# Altium project LM-003-D.PrjPcb
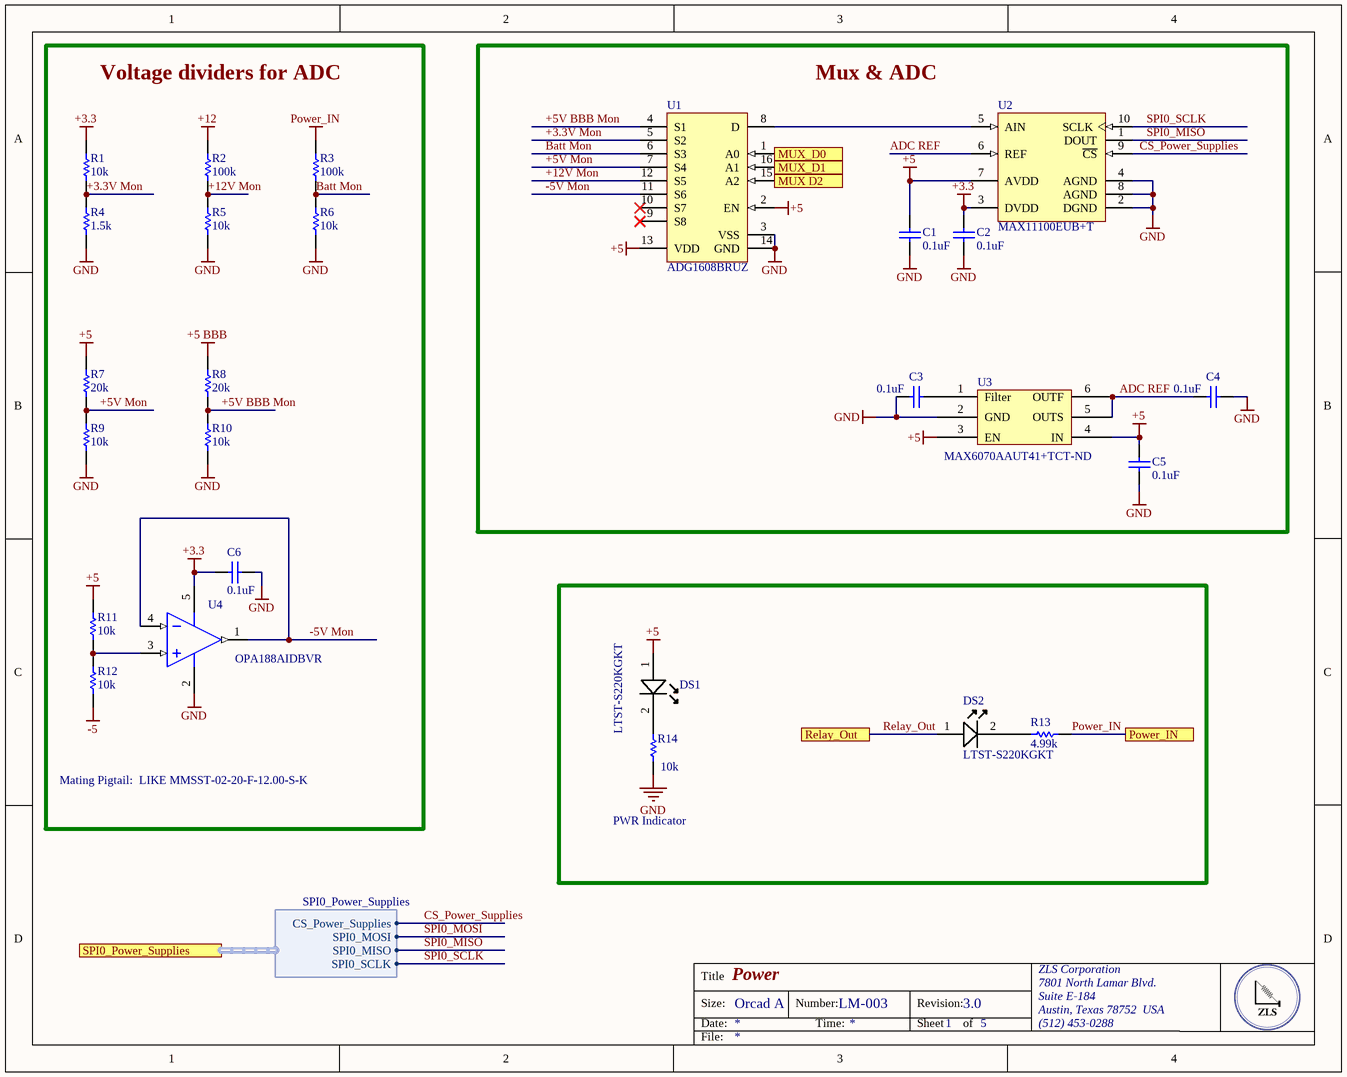
[diagram p0: Power.SchDoc]
4 sheets, 55 parts. Net scope: flat (ports and power ports of the same name join across sheets).
Board file: LM-003.PcbDoc
Sheets:
  Power.SchDoc
  BBB Headers.SchDoc
  Connectors.SchDoc
  heater_control.SchDoc

## Sheet Power.SchDoc: Power
size OrCAD A; DocumentNumber: LM-003; Revision: 3.0; SheetNumber: 1; SheetTotal: 5

### Parts
C1  0.1uF  [CAPC0402(1005)60_L]
C2  0.1uF  [CAPC0402(1005)60_L]
C3  0.1uF  [CAPC0402(1005)60_L]
C4  0.1uF  [CAPC0402(1005)60_L]
C5  0.1uF  [CAPC0402(1005)60_L]
C6  0.1uF  [CAPC0402(1005)60_L]
DS1  Manufacturer Part Number: LTST-S220KGKT  [0805C_L]  (hidden comment: Lite-On LTST-S220KGKT Green LED, 571 nm 2012 (0805) Side View, Rectangle Lens SMD package)
DS2  Manufacturer Part Number: LTST-S220KGKT  [0805C_L]  (hidden comment: Lite-On LTST-S220KGKT Green LED, 571 nm 2012 (0805) Side View, Rectangle Lens SMD package)
R1  10k  [RESC0402(1005)_M]
R2  100k  [RESC0402(1005)_M]
R3  100k  [RESC0402(1005)_M]
R4  1.5k  [RESC0402(1005)_M]
R5  10k  [RESC0402(1005)_M]
R6  10k  [RESC0402(1005)_M]
R7  20k  [RESC0402(1005)_M]
R8  20k  [RESC0402(1005)_M]
R9  10k  [RESC0402(1005)_M]
R10  10k  [RESC0402(1005)_M]
R11  10k  [RESC0402(1005)_M]
R12  10k  [RESC0402(1005)_M]
R13  4.99k  [RESC0402(1005)_M]
R14  10k  [RESC0402(1005)_M]
U1  ADG1608BRUZ  [ADI-RU-16_M]
U2  MAX11100EUB+T  [U10+2_L]
U3  Supplier Part Number 1: MAX6070AAUT41+TCT-ND  [SOT95P280X445-6N]  (hidden comment: MAX6070AAUT41+T)
U4  OPA188AIDBVR  [DBV0005A_M]

### Blocks framed on the sheet
Voltage dividers for ADC: C6 R1-R12 U4
Mux & ADC: C1-C5 U1-U3
PWR Indicator: DS1 DS2 R13 R14

### Ports
MUX D2, MUX_D0, MUX_D1, Power_IN, Relay_Out, SPI0_Power_Supplies (harness SPI0_Power_Supplies)

### Harnesses
SPI0_Power_Supplies: CS_Power_Supplies, SPI0_MOSI, SPI0_MISO, SPI0_SCLK

### Nets
+3.3: C2.1 C6.1 R1.2 U2.3(DVDD) U4.5(V+)
+5: C1.1 C5.1 DS1.1(A) R7.2 R11.2 U1.2(EN) U1.13(VDD) U2.7(AVDD) U3.3(EN) U3.4(IN)
+5 BBB: R8.2
+12: R2.2
-5: R12.1
GND: C1.2 C2.2 C3.2 C4.1 C5.2 C6.2 R4.1 R5.1 R6.1 R9.1 R10.1 R14.2 U1.3(VSS) U1.14(GND) U2.2(DGND) U2.4(AGND) U2.8(AGND) U3.2(GND) U4.2(V-)
Power_IN: R3.2 R13.2 ; port Power_IN
+3.3V Mon: R1.1 R4.2 U1.5(S2)
+5V BBB Mon: R8.1 R10.2 U1.4(S1)
+5V Mon: R7.1 R9.2 U1.7(S4)
+12V Mon: R2.1 R5.2 U1.12(S5)
-5V Mon: U1.11(S6) U4.1(OUT) U4.4(IN-)
ADC REF: C4.2 U2.6(REF) U3.5(OUTS) U3.6(OUTF)
Batt Mon: R3.1 R6.2 U1.6(S3)
CS_Power_Supplies: U2.9(~{CS}) ; port SPI0_Power_Supplies.CS_Power_Supplies
Relay_Out: DS2.1(A) ; port Relay_Out
SPI0_MISO: U2.1(DOUT) ; port SPI0_Power_Supplies.SPI0_MISO
SPI0_MOSI: port SPI0_Power_Supplies.SPI0_MOSI
SPI0_SCLK: U2.10(SCLK) ; port SPI0_Power_Supplies.SPI0_SCLK
NetC3_1: C3.1 U3.1(Filter)
NetDS1_2: DS1.2(K) R14.1
NetDS2_2: DS2.2(K) R13.1
NetR11_1: R11.1 R12.2 U4.3(IN+)
NetU1_1: U1.1(A0) ; port MUX_D0
NetU1_8: U1.8(D) U2.5(AIN)
NetU1_15: U1.15(A2) ; port MUX D2
NetU1_16: U1.16(A1) ; port MUX_D1

Not connected (* = marked no-connect by the designer): U1 9(S8)* 10(S7)*

### Notes on the sheet
- Mating Pigtail:  LIKE MMSST-02-20-F-12.00-S-K
- Title
- Size:
- Date:
- Orcad A
- Number:
- Time:
- Revision:
- Sheet
- of
- ZLS Corporation
- 7801 North Lamar Blvd.
- Suite E-184
- Austin, Texas 78752  USA
- (512) 453-0288
- File:

### Library data of the parts
C1-C6 = CMP-1034-00252-1: CAP CER 0.1UF 10V X7R 0402; Manufacturer: Murata Electronics North America; Manufacturer Part Number: GRM155R71A104KA01D; Tolerance: ±10%; Supplier 1: Digi-Key; Supplier Part Number 1: 490-6321-1-ND; RoHS: RoHS Compliant; Category: Capacitors; Stock 1: 2920395; Pricing 1: 1=0.1, 10=0.014, 100=0.0063, 500=0.00446, 1000=0.00351, 2500=0.00319, 5000=0.00293 (USD); Packaging: Cut Tape (CT); Part Status: Active; Voltage - Rated: 10V; Temperature Coefficient: X7R; Operating Temperature: -55°C ~ 125°C; Features: -; Ratings: -; Applications: General Purpose; Mounting Type: Surface Mount, MLCC; Package / Case: 0402 (1005 Metric); Size / Dimension: 0.039" L x 0.020" W (1.00mm x 0.50mm); Height - Seated (Max): -; Thickness (Max): 0.022" (0.55mm); Lead Spacing: -; ComponentLink1URL: http://www.murata.com/~/media/webrenewal/support/library/catalog/products/capacitor/mlcc/c02e.ashx?la=en-us; ComponentLink1Description: http://www.murata.com/~/media/webrenewal/support/library/catalog/products/capacitor/mlcc/c02e.ashx?la=en-us
DS1 DS2 = LED A/K: Manufacturer: Vishay / Lite-On; Lens Colour: Colorless; Viewing Angle: 130°; Luminous Intensity: 35mcd; Forward Current: 20mA; Forward Voltage: 2V; Lens Style: Diffused,Colorless; Power Rating: 75mW; Dominant Wavelength: 568nm; Lens Transparency: Clear; Number of Elements: 1; Power Dissipation: 75W; Wavelength: 574nm; Supplier 1: Digi-Key; Supplier Part Number 1: 160-1468-1-ND; Stock 1: 74800; Pricing 1: 1=0.29, 10=0.212, 25=0.1564, 100=0.1117, 250=0.0759, 500=0.067, 1000=0.0525 (USD); Mount: Surface Mount; Case/Package: 0805; Number of Pins: 2; Colour: Green; Case Code (Metric): 2012; Case Code (Imperial): 0805; Min Operating Temperature: -55°C; Max Operating Temperature: 85°C; Packaging: Tape and Reel; Package Quantity: 4000; Illumination Colour: Green; Test Current: 20mA; Number of LEDs: 1; Length: 2.1mm; Height: 0.6mm; Width: 1mm; Depth: 0.6mm; Radiation Hardening: No; Lead Free: Lead Free; ComponentLink1URL: https://datasheet.ciiva.com/11775/0900766b80dc0b70-11775441.pdf; ComponentLink1Description: https://datasheet.ciiva.com/11775/0900766b80dc0b70-11775441.pdf; ComponentLink2URL: https://datasheet.ciiva.com/2110/s-110-ltst-s220kgkt-2110069.pdf; ComponentLink2Description: https://datasheet.ciiva.com/2110/s-110-ltst-s220kgkt-2110069.pdf; ComponentLink3URL: https://datasheet.ciiva.com/2110/s-110-ltst-s220kgkt-2110070.pdf; ComponentLink3Description: https://datasheet.ciiva.com/2110/s-110-ltst-s220kgkt-2110070.pdf; ComponentLink4URL: https://datasheet.ciiva.com/12400/100-ltst-s220kgkt-59602-12400886.pdf; ComponentLink4Description: https://datasheet.ciiva.com/12400/100-ltst-s220kgkt-59602-12400886.pdf; ComponentLink5URL: https://datasheet.ciiva.com/2110/s-110-ltst-s220kgkt-2110071.pdf; ComponentLink5Description: https://datasheet.ciiva.com/2110/s-110-ltst-s220kgkt-2110071.pdf; ComponentLink6URL: https://datasheet.ciiva.com/16379/ltst-s220kgkt-16379082.pdf; ComponentLink6Description: https://datasheet.ciiva.com/16379/ltst-s220kgkt-16379082.pdf
  DS2: Supplier 2: Farnell; Supplier Part Number 2: 2062310; RoHS: YES; Stock 2: 2271; Pricing 2: 1=0.325, 10=0.317, 100=0.23, 200=0.228, 400=0.182, 900=0.147, 3000=0.114, 9000=0.107 (GBP); ComponentLink7URL: http://www.farnell.com/cad/2124774.pdf; ComponentLink7Description: http://www.farnell.com/cad/2124774.pdf; ComponentLink8URL: http://www.farnell.com/datasheets/693084.pdf; ComponentLink8Description: http://www.farnell.com/datasheets/693084.pdf
R1-R14 = CMP-1011-00651-1
U1 = CMP-0793-00136-1: 4.5 Ohm Ron, 8-Channel +/-5 V,+12 V, +5 V and +3.3 V Multiplexer, 16-pin SOP (RU-16), Tube; Manufacturer: Analog Devices; Max Analog Signal Range: 0 to Vdd; Ron (ohms): 4.4; t transition (s): 150n; Bandwidth (Hz): 40M, 40M, 37M, 34M; Code_JEDEC: MO-153AB; PackageReference: RU-16; PackageDescription: 16-Pin Thin Shrink Small Outline Package, Body 5 x 4.4 mm, Pitch 0.65 mm; ComponentLink1Description: Manufacturer URL; ComponentLink2Description: Datasheet; PartNumber: ADG1608BRUZ; Mounting Technology: Surface Mount; PackageVersion: Nov-02; ComponentLink3Description: Package Specification; DatasheetVersion: Rev. 0; Packing: Tube; ComponentLink1URL: http://www.analog.com/en/index.html; ComponentLink3URL: http:/www.analog.com/static/imported-files/packages/36244347913743854010197452789RU16.pdf; ComponentLink2URL: http://www.analog.com/static/imported-files/data_sheets/ADG1608_1609.pdf
U2 = CMP-0249-00017-1: 16-Bit, +5V, 200ksps ADC with 10uA Shutdown, 10-Pin uMAX, -40°C to +85°C, Pb-Free, Tape and Reel; DatasheetVersion: Rev 1, Jan-2012; ComponentLink3URL: http://pdfserv.maxim-ic.com/package_dwgs/21-0061.PDF; PackageReference: U10+2; ComponentLink2URL: http://datasheets.maxim-ic.com/en/ds/MAX11100.pdf; PackageVersion: revL, 2008; ComponentLink1Description: Manufacturer URL; Code_JEDEC: MO-187-BA; ComponentLink1URL: http://www.maxim-ic.com; ComponentLink3Description: Package Specification; PackageDescription: 10-Pin Micro-MAX Thin Shrink Small Outline (uSOP), 3 x 3 x 0.85 mm Body, 0.5 mm Pitch, Pb-Free; ComponentLink2Description: Datasheet
U3 = MAX6070AAUT41+T: IC VREF SERIES 4.096V SOT23; Manufacturer: Maxim Integrated; Output Type: Fixed; Tolerance: ±0.04%; Temperature Coefficient: 6ppm/°C; Noise - 0.1Hz to 10Hz: 9.6µVp-p; Noise - 10Hz to 10kHz: 9µVrms; Voltage - Input: 4.3 V ~ 5.5 V; Current - Supply: 350µA; Supplier 1: Digi-Key; Manufacturer Part Number: MAX6070AAUT41+T; RoHS: RoHS Compliant; Category: Integrated Circuits (ICs); Stock 1: 2623; Pricing 1: 1=3.41, 10=3.213, 25=2.5704, 50=2.4418, 100=2.2491, 250=2.13344, 500=2.05634 (USD); Packaging: Cut Tape (CT); Part Status: Active; Reference Type: Series; Voltage - Output (Min/Fixed): 4.096V; Operating Temperature: -40°C ~ 125°C (TA); Mounting Type: Surface Mount; Package / Case: SOT-23-6; Supplier Device Package: SOT-23-6; ComponentLink1URL: https://datasheets.maximintegrated.com/en/ds/MAX6070-MAX6071.pdf; ComponentLink1Description: https://datasheets.maximintegrated.com/en/ds/MAX6070-MAX6071.pdf
U4 = CMP-0809-00005-2: Precision, Low Noise, Rail-to-Rail Output, Zero-Drift Operational Amplifier, 4 to 36 V, -40 to 125 degC, 5-pin SOT23 (DBV5), Green (RoHS & no Sb/Br); Manufacturer: Texas Instruments; Total Supply Voltage(Min)(+5V is 5, +/-5V is 10): 4; Offset Drift(Typ)(uV/C): 0.03; Rating: Catalog; SubFamily: Zero Drift Precision Amplifier; GBW(Typ)(MHz): 2; Slew Rate(Typ)(V/us): 0.8; Number of Channels: 1; CMRR(Min)(dB): 120; Iq per channel(Max)(mA): 0.51; Total Supply Voltage(Max)(+5V is 5, +/-5V is 10): 36; PartNumber: OPA188AIDBVR; ComponentLink2Description: Datasheet; ComponentLink2URL: http://www.ti.com/lit/ds/symlink/opa188.pdf; ComponentLink1Description: Manufacturer URL; Mounting Technology: Surface Mount; Eco-Plan: Green (RoHS & no Sb/Br); ComponentLink1URL: http://www.ti.com/; PackageVersion: 4073253-4/K, 03/2006; DatasheetVersion: SBOS642A; ComponentLink3Description: Package Specification; PackageReference: DBV0005A; ComponentLink3URL: http://www.ti.com/litv/pdf/mpds018i; PackageDescription: 5-Pin Plastic Small Outline, Body 1.6 x 2.9 mm, Pitch 0.95 mm; Code_JEDEC: MO-178

## Sheet BBB Headers.SchDoc: BBB Headers
size Tabloid; DocumentNumber: LM-003; Revision: 3.0; SheetNumber: 2; SheetTotal: 5
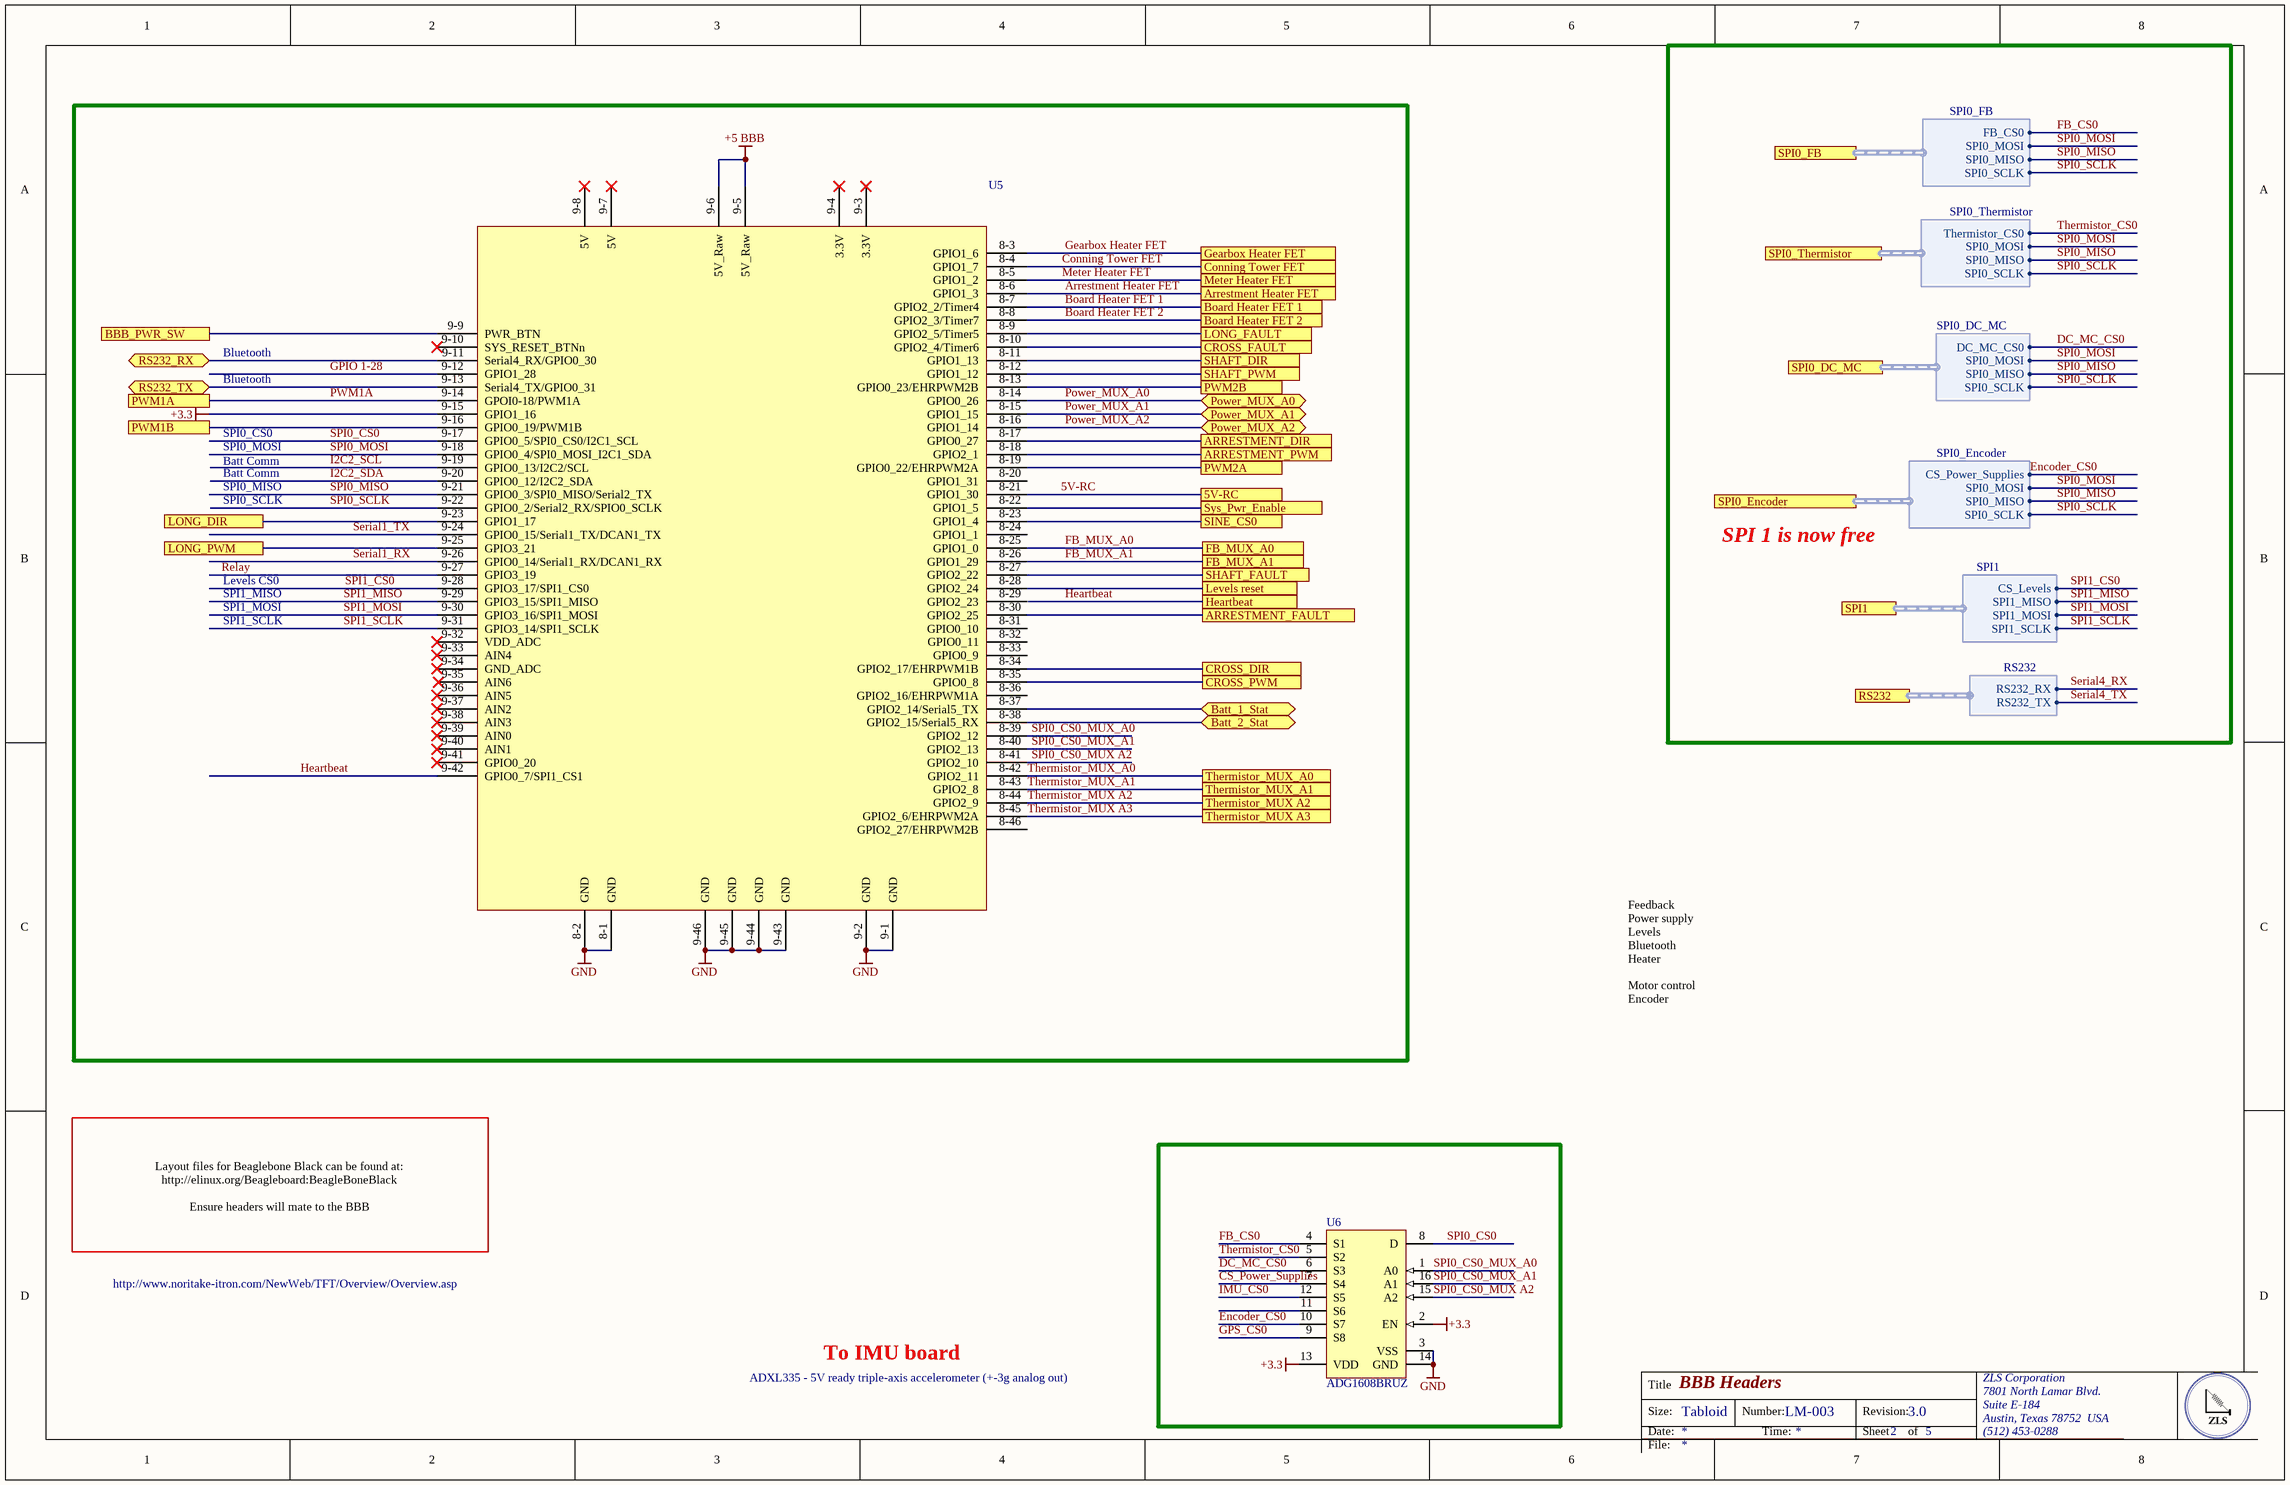
[diagram p1: BBB Headers.SchDoc]

### Parts
U5  BBB  [Beaglebone Black]  (value not drawn)
U6  ADG1608BRUZ  [ADI-RU-16_M]

### Ports
5V-RC, Arrestment Heater FET, ARRESTMENT_DIR, ARRESTMENT_FAULT, ARRESTMENT_PWM, Batt_1_Stat, Batt_2_Stat, BBB_PWR_SW, Board Heater FET 1, Board Heater FET 2, Conning Tower FET, CROSS_DIR, CROSS_FAULT, CROSS_PWM, FB_MUX_A0, FB_MUX_A1, Gearbox Heater FET, Heartbeat, Levels reset, LONG_DIR, LONG_FAULT, LONG_PWM, Meter Heater FET, Power_MUX_A0, Power_MUX_A1, Power_MUX_A2, PWM1A, PWM1B, PWM2A, PWM2B, RS232 (harness RS232), RS232_RX, RS232_TX, SHAFT_DIR, SHAFT_FAULT, SHAFT_PWM, SINE_CS0, SPI0_DC_MC (harness SPI0_DC_MC), SPI0_Encoder (harness SPI0_Encoder), SPI0_FB (harness SPI0_FB), SPI0_Thermistor (harness SPI0_Thermistor), SPI1 (harness SPI1), Sys_Pwr_Enable, Thermistor_MUX A2, Thermistor_MUX A3, Thermistor_MUX_A0, Thermistor_MUX_A1

### Harnesses
RS232: RS232_RX, RS232_TX
SPI1: CS_Levels, SPI1_MISO, SPI1_MOSI, SPI1_SCLK
SPI0_DC_MC: DC_MC_CS0, SPI0_MOSI, SPI0_MISO, SPI0_SCLK
SPI0_Encoder: CS_Power_Supplies, SPI0_MOSI, SPI0_MISO, SPI0_SCLK
SPI0_Thermistor: Thermistor_CS0, SPI0_MOSI, SPI0_MISO, SPI0_SCLK
SPI0_FB: FB_CS0, SPI0_MOSI, SPI0_MISO, SPI0_SCLK

### Nets
+3.3: U5.9-15(GPIO1_16) U6.2(EN) U6.13(VDD)
+5 BBB: U5.9-5(5V_Raw) U5.9-6(5V_Raw)
GND: U5.8-1(GND) U5.8-2(GND) U5.9-1(GND) U5.9-2(GND) U5.9-43(GND) U5.9-44(GND) U5.9-45(GND) U5.9-46(GND) U6.3(VSS) U6.14(GND)
5V-RC: U5.8-21(GPIO1_30) ; port 5V-RC
Arrestment Heater FET: U5.8-6(GPIO1_3) ; port Arrestment Heater FET
Batt_1_Stat: U5.8-37(GPIO2_14/Serial5_TX) ; port Batt_1_Stat
Batt_2_Stat: U5.8-38(GPIO2_15/Serial5_RX) ; port Batt_2_Stat
BBB_PWR_SW: U5.9-9(PWR_BTN) ; port BBB_PWR_SW
Board Heater FET 1: U5.8-7(GPIO2_2/Timer4) ; port Board Heater FET 1
Board Heater FET 2: U5.8-8(GPIO2_3/Timer7) ; port Board Heater FET 2
Conning Tower FET: U5.8-4(GPIO1_7) ; port Conning Tower FET
CS_Power_Supplies: U6.7(S4)
DC_MC_CS0: U6.6(S3) ; port SPI0_DC_MC.DC_MC_CS0
Encoder_CS0: U6.10(S7) ; port SPI0_Encoder.CS_Power_Supplies
FB_CS0: U6.4(S1) ; port SPI0_FB.FB_CS0
FB_MUX_A0: U5.8-25(GPIO1_0) ; port FB_MUX_A0
FB_MUX_A1: U5.8-26(GPIO1_29) ; port FB_MUX_A1
Gearbox Heater FET: U5.8-3(GPIO1_6) ; port Gearbox Heater FET
GPIO 1-28: U5.9-12(GPIO1_28)
GPS_CS0: U6.9(S8)
Heartbeat: U5.9-42(GPIO0_7/SPI1_CS1) ; port Heartbeat
I2C2_SCL: U5.9-19(GPIO0_13/I2C2/SCL)
I2C2_SDA: U5.9-20(GPIO0_12/I2C2_SDA)
IMU_CS0: U6.12(S5)
Meter Heater FET: U5.8-5(GPIO1_2) ; port Meter Heater FET
Power_MUX_A0: U5.8-14(GPIO0_26) ; port Power_MUX_A0
Power_MUX_A1: U5.8-15(GPIO1_15) ; port Power_MUX_A1
Power_MUX_A2: U5.8-16(GPIO1_14) ; port Power_MUX_A2
PWM1A: U5.9-14(GPOI0-18/PWM1A) ; port PWM1A
PWM2A: U5.8-19(GPIO0_22/EHRPWM2A) ; port PWM2A
PWM2B: U5.8-13(GPIO0_23/EHRPWM2B) ; port PWM2B
Relay: U5.9-27(GPIO3_19)
Serial1_RX: U5.9-26(GPIO0_14/Serial1_RX/DCAN1_RX)
Serial1_TX: U5.9-24(GPIO0_15/Serial1_TX/DCAN1_TX)
Serial4_RX: port RS232.RS232_RX
Serial4_TX: port RS232.RS232_TX
SPI0_CS0: U5.9-17(GPIO0_5/SPI0_CS0/I2C1_SCL) U6.8(D)
SPI0_CS0_MUX A2: U5.8-41(GPIO2_10) U6.15(A2)
SPI0_CS0_MUX_A0: U5.8-39(GPIO2_12) U6.1(A0)
SPI0_CS0_MUX_A1: U5.8-40(GPIO2_13) U6.16(A1)
SPI0_MISO: U5.9-21(GPIO0_3/SPI0_MISO/Serial2_TX) ; port SPI0_DC_MC.SPI0_MISO, port SPI0_Encoder.SPI0_MISO, port SPI0_Thermistor.SPI0_MISO, port SPI0_FB.SPI0_MISO
SPI0_MOSI: U5.9-18(GPIO0_4/SPI0_MOSI_I2C1_SDA) ; port SPI0_DC_MC.SPI0_MOSI, port SPI0_Encoder.SPI0_MOSI, port SPI0_Thermistor.SPI0_MOSI, port SPI0_FB.SPI0_MOSI
SPI0_SCLK: U5.9-22(GPIO0_2/Serial2_RX/SPIO0_SCLK) ; port SPI0_DC_MC.SPI0_SCLK, port SPI0_Encoder.SPI0_SCLK, port SPI0_Thermistor.SPI0_SCLK, port SPI0_FB.SPI0_SCLK
SPI1_CS0: U5.9-28(GPIO3_17/SPI1_CS0) ; port SPI1.CS_Levels
SPI1_MISO: U5.9-29(GPIO3_15/SPI1_MISO) ; port SPI1.SPI1_MISO
SPI1_MOSI: U5.9-30(GPIO3_16/SPI1_MOSI) ; port SPI1.SPI1_MOSI
SPI1_SCLK: U5.9-31(GPIO3_14/SPI1_SCLK) ; port SPI1.SPI1_SCLK
Sys_Pwr_Enable: U5.8-22(GPIO1_5) ; port Sys_Pwr_Enable
Thermistor_CS0: U6.5(S2) ; port SPI0_Thermistor.Thermistor_CS0
Thermistor_MUX A2: U5.8-44(GPIO2_9) ; port Thermistor_MUX A2
Thermistor_MUX A3: U5.8-45(GPIO2_6/EHRPWM2A) ; port Thermistor_MUX A3
Thermistor_MUX_A0: U5.8-42(GPIO2_11) ; port Thermistor_MUX_A0
Thermistor_MUX_A1: U5.8-43(GPIO2_8) ; port Thermistor_MUX_A1
NetU5_8-9: U5.8-9(GPIO2_5/Timer5) ; port LONG_FAULT
NetU5_8-10: U5.8-10(GPIO2_4/Timer6) ; port CROSS_FAULT
NetU5_8-11: U5.8-11(GPIO1_13) ; port SHAFT_DIR
NetU5_8-12: U5.8-12(GPIO1_12) ; port SHAFT_PWM
NetU5_8-17: U5.8-17(GPIO0_27) ; port ARRESTMENT_DIR
NetU5_8-18: U5.8-18(GPIO2_1) ; port ARRESTMENT_PWM
NetU5_8-23: U5.8-23(GPIO1_4) ; port SINE_CS0
NetU5_8-27: U5.8-27(GPIO2_22) ; port SHAFT_FAULT
NetU5_8-28: U5.8-28(GPIO2_24) ; port Levels reset
NetU5_8-30: U5.8-30(GPIO2_25) ; port ARRESTMENT_FAULT
NetU5_8-34: U5.8-34(GPIO2_17/EHRPWM1B) ; port CROSS_DIR
NetU5_8-35: U5.8-35(GPIO0_8) ; port CROSS_PWM
NetU5_9-11: U5.9-11(Serial4_RX/GPIO0_30) ; port RS232_RX
NetU5_9-13: U5.9-13(Serial4_TX/GPIO0_31) ; port RS232_TX
NetU5_9-16: U5.9-16(GPIO0_19/PWM1B) ; port PWM1B
NetU5_9-23: U5.9-23(GPIO1_17) ; port LONG_DIR
NetU5_9-25: U5.9-25(GPIO3_21) ; port LONG_PWM

Not connected (* = marked no-connect by the designer): U5 8-20(GPIO1_31) 8-24(GPIO1_1) 8-29(GPIO2_23) 8-31(GPIO0_10) 8-32(GPIO0_11) 8-33(GPIO0_9) 8-36(GPIO2_16/EHRPWM1A) 8-46(GPIO2_27/EHRPWM2B) 9-3(3.3V)* 9-4(3.3V)* 9-7(5V)* 9-8(5V)* 9-10(SYS_RESET_BTNn)* 9-32(VDD_ADC)* 9-33(AIN4)* 9-34(GND_ADC)* 9-35(AIN6) 9-36(AIN5)* 9-37(AIN2)* 9-38(AIN3)* 9-39(AIN0)* 9-40(AIN1)* 9-41(GPIO0_20)*; U6 11(S6)

### Notes on the sheet
- Bluetooth
- SPI0_CS0
- SPI0_MISO
- SPI0_MOSI
- Batt Comm
- SPI0_SCLK
- SPI 1 is now free
- SPI1_MISO
- SPI1_SCLK
- Levels CS0
- SPI1_MOSI
- Feedback
  Power supply
  Levels
  Bluetooth
  Heater
  Motor control
  Encoder
- Layout files for Beaglebone Black can be found at:
  http://elinux.org/Beagleboard:BeagleBoneBlack
  Ensure headers will mate to the BBB
- http://www.noritake-itron.com/NewWeb/TFT/Overview/Overview.asp
- To IMU board
- ADXL335 - 5V ready triple-axis accelerometer (+-3g analog out)
- Title
- Size:
- Date:
- Tabloid
- Number:
- Time:
- Revision:
- Sheet
- of
- ZLS Corporation
- 7801 North Lamar Blvd.
- Suite E-184
- Austin, Texas 78752  USA
- (512) 453-0288
- File:

### Library data of the parts
U5 = Beaglebone_Black: Beaglebone Black; Manufacturer: Molex, LLC; Manufacturer Part Number: 0010897462; Connector Type: Header, Breakaway; Pitch - Mating: 0.100" (2.54mm); Style: Board to Board or Cable; Shrouding: Unshrouded; Number of Positions: 46; Number of Positions Loaded: All; Contact Length - Mating: 0.240" (6.10mm); Contact Length - Post: 0.107" (2.71mm); Overall Contact Length: 0.437" (11.10mm); Material Flammability Rating: UL94 V-0; Supplier 1: Digi-Key; Supplier Part Number 1: WM50012-46-ND; RoHS: RoHS Compliant; Category: Connectors, Interconnects; Stock 1: 407; Pricing 1: 1=7.65, 10=7.336, 25=6.698, 50=6.379, 100=6.0601, 250=5.4222, 500=5.10324 (USD); Packaging: Bulk; Part Status: Active; Contact Type: Male Pin; Number of Rows: 2; Row Spacing - Mating: 0.100" (2.54mm); Mounting Type: Through Hole; Termination: Solder; Fastening Type: -; Insulation Height: 0.090" (2.29mm); Contact Shape: Square; Contact Finish - Mating: Gold; Contact Finish Thickness - Mating: 15µin (0.38µm); Contact Finish - Post: Tin; Contact Material: Copper Alloy; Insulation Material: Liquid Crystal Polymer (LCP), Glass Filled; Features: -; Operating Temperature: -; Ingress Protection: -; Insulation Color: Black; Current Rating: -; Voltage Rating: -; Mated Stacking Heights: -; Contact Finish Thickness - Post: 74.8µin (1.90µm); Applications: Automotive, General Purpose, Lighting, Medical, Telecommunications; ComponentLink1URL: http://www.molex.com/pdm_docs/sd/010897041_sd.pdf; ComponentLink1Description: http://www.molex.com/pdm_docs/sd/010897041_sd.pdf
U6 = CMP-0793-00136-1: as U1 on sheet Power; Code_JEDEC: MO-153AB; PackageReference: RU-16; PackageDescription: 16-Pin Thin Shrink Small Outline Package, Body 5 x 4.4 mm, Pitch 0.65 mm; ComponentLink1Description: Manufacturer URL; ComponentLink2Description: Datasheet; PartNumber: ADG1608BRUZ; Mounting Technology: Surface Mount; PackageVersion: Nov-02; ComponentLink3Description: Package Specification; DatasheetVersion: Rev. 0; Packing: Tube; ComponentLink1URL: http://www.analog.com/en/index.html; ComponentLink3URL: http:/www.analog.com/static/imported-files/packages/36244347913743854010197452789RU16.pdf; ComponentLink2URL: http://www.analog.com/static/imported-files/data_sheets/ADG1608_1609.pdf

## Sheet Connectors.SchDoc: Connectors
size OrCAD A; DocumentNumber: LM-003; Revision: 3.0; SheetNumber: 3; SheetTotal: 5
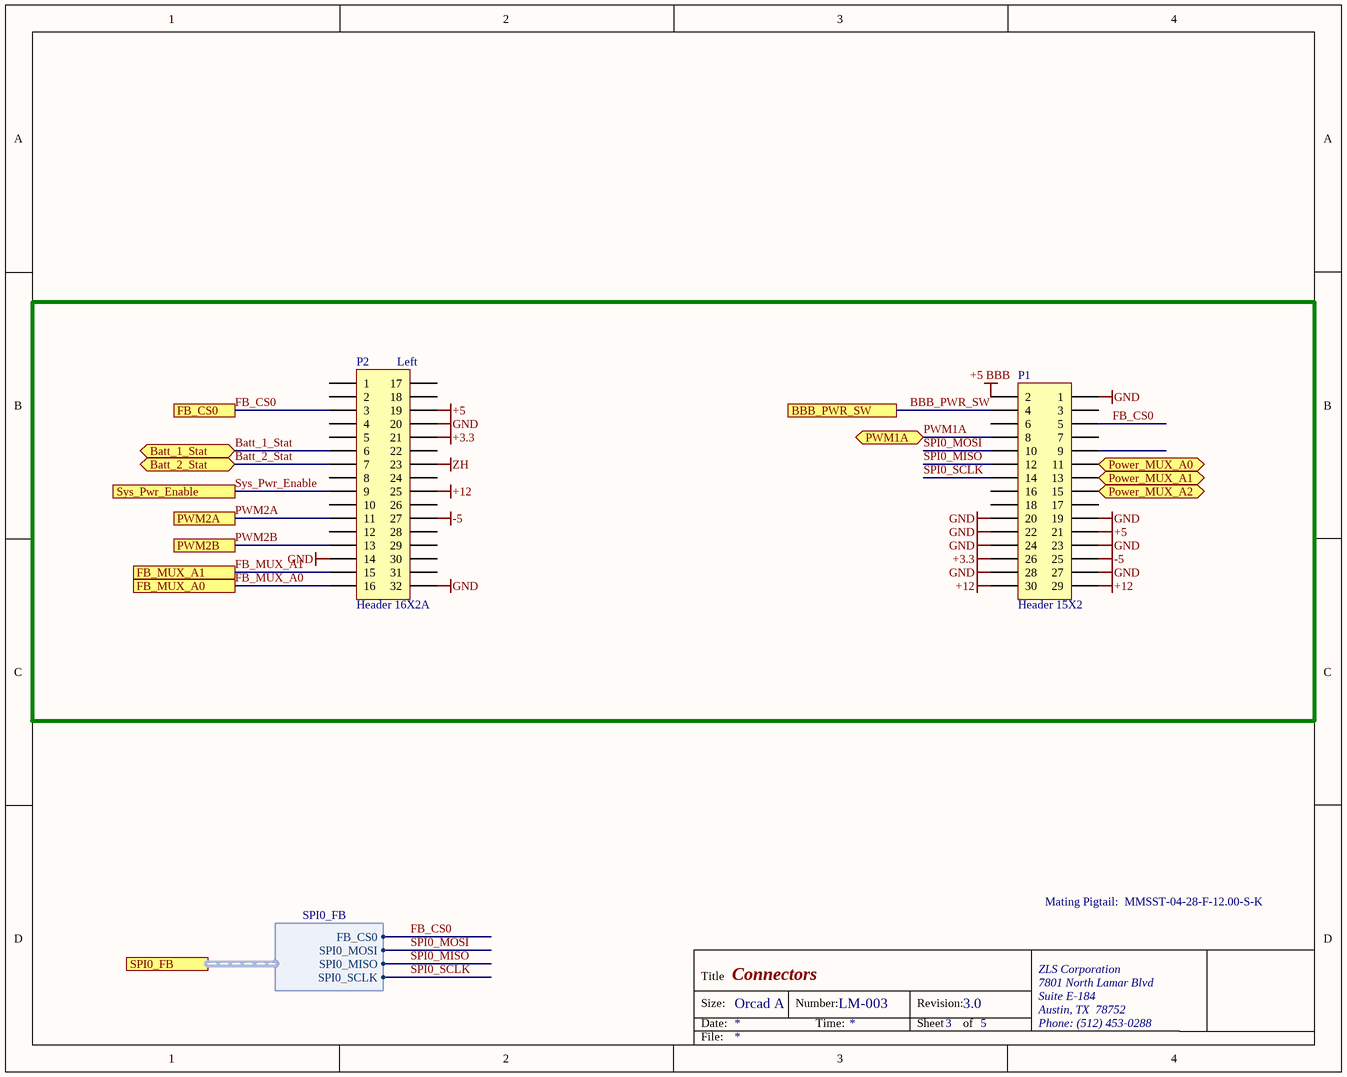
[diagram p2: Connectors.SchDoc]

### Parts
P1  Header 15X2  [HDR2X15]
P2  Header 16X2A  [HDR2X16_CEN]

### Blocks framed on the sheet
Left: P1 P2

### Ports
Batt_1_Stat, Batt_2_Stat, BBB_PWR_SW, FB_CS0, FB_MUX_A0, FB_MUX_A1, Power_MUX_A0, Power_MUX_A1, Power_MUX_A2, PWM1A, PWM2A, PWM2B, SPI0_FB (harness SPI0_FB), Sys_Pwr_Enable

### Harnesses
SPI0_FB: FB_CS0, SPI0_MOSI, SPI0_MISO, SPI0_SCLK

### Nets
+3.3: P1.26 P2.21
+5: P1.21 P2.19
+5 BBB: P1.2
+12: P1.29 P1.30 P2.25
-5: P1.25 P2.27
GND: P1.1 P1.19 P1.20 P1.22 P1.23 P1.24 P1.27 P1.28 P2.14 P2.20 P2.32
ZH: P2.23
Batt_1_Stat: P2.6 ; port Batt_1_Stat
Batt_2_Stat: P2.7 ; port Batt_2_Stat
BBB_PWR_SW: P1.4 ; port BBB_PWR_SW
FB_CS0: P1.5 P2.3 ; port FB_CS0, port SPI0_FB.FB_CS0
FB_MUX_A0: P2.16 ; port FB_MUX_A0
FB_MUX_A1: P2.15 ; port FB_MUX_A1
Power_MUX_A0: P1.11 ; port Power_MUX_A0
Power_MUX_A1: P1.13 ; port Power_MUX_A1
Power_MUX_A2: P1.15 ; port Power_MUX_A2
PWM1A: P1.8 ; port PWM1A
PWM2A: P2.11 ; port PWM2A
PWM2B: P2.13 ; port PWM2B
SPI0_MISO: P1.12 ; port SPI0_FB.SPI0_MISO
SPI0_MOSI: P1.10 ; port SPI0_FB.SPI0_MOSI
SPI0_SCLK: P1.14 ; port SPI0_FB.SPI0_SCLK
Sys_Pwr_Enable: P2.9 ; port Sys_Pwr_Enable

Not connected (* = marked no-connect by the designer): P1 3 6 7 9 16 17 18; P2 1 2 4 5 8 10 12 17 18 22 24 26 28 29 30 31

### Notes on the sheet
- Mating Pigtail:  MMSST-04-28-F-12.00-S-K
- Title
- Size:
- Date:
- Orcad A
- Number:
- Time:
- Revision:
- Sheet
- of
- ZLS Corporation
- 7801 North Lamar Blvd
- Suite E-184
- Austin, TX  78752
- Phone: (512) 453-0288
- File:

### Library data of the parts
P1 = Header 15X2: Header, 15-Pin, Dual row; LatestRevisionDate: 17-Jul-2002; LatestRevisionNote: Re-released for DXP Platform.; Publisher: Altium Limited
P2 = Header 16X2A: Header, 16-Pin, Dual row; LatestRevisionDate: 17-Jul-2002; LatestRevisionNote: Re-released for DXP Platform.; Publisher: Altium Limited

## Sheet heater_control.SchDoc: Heater Control
size Tabloid; DocumentNumber: LM-003; Revision: 3.0; SheetNumber: 5; SheetTotal: 5
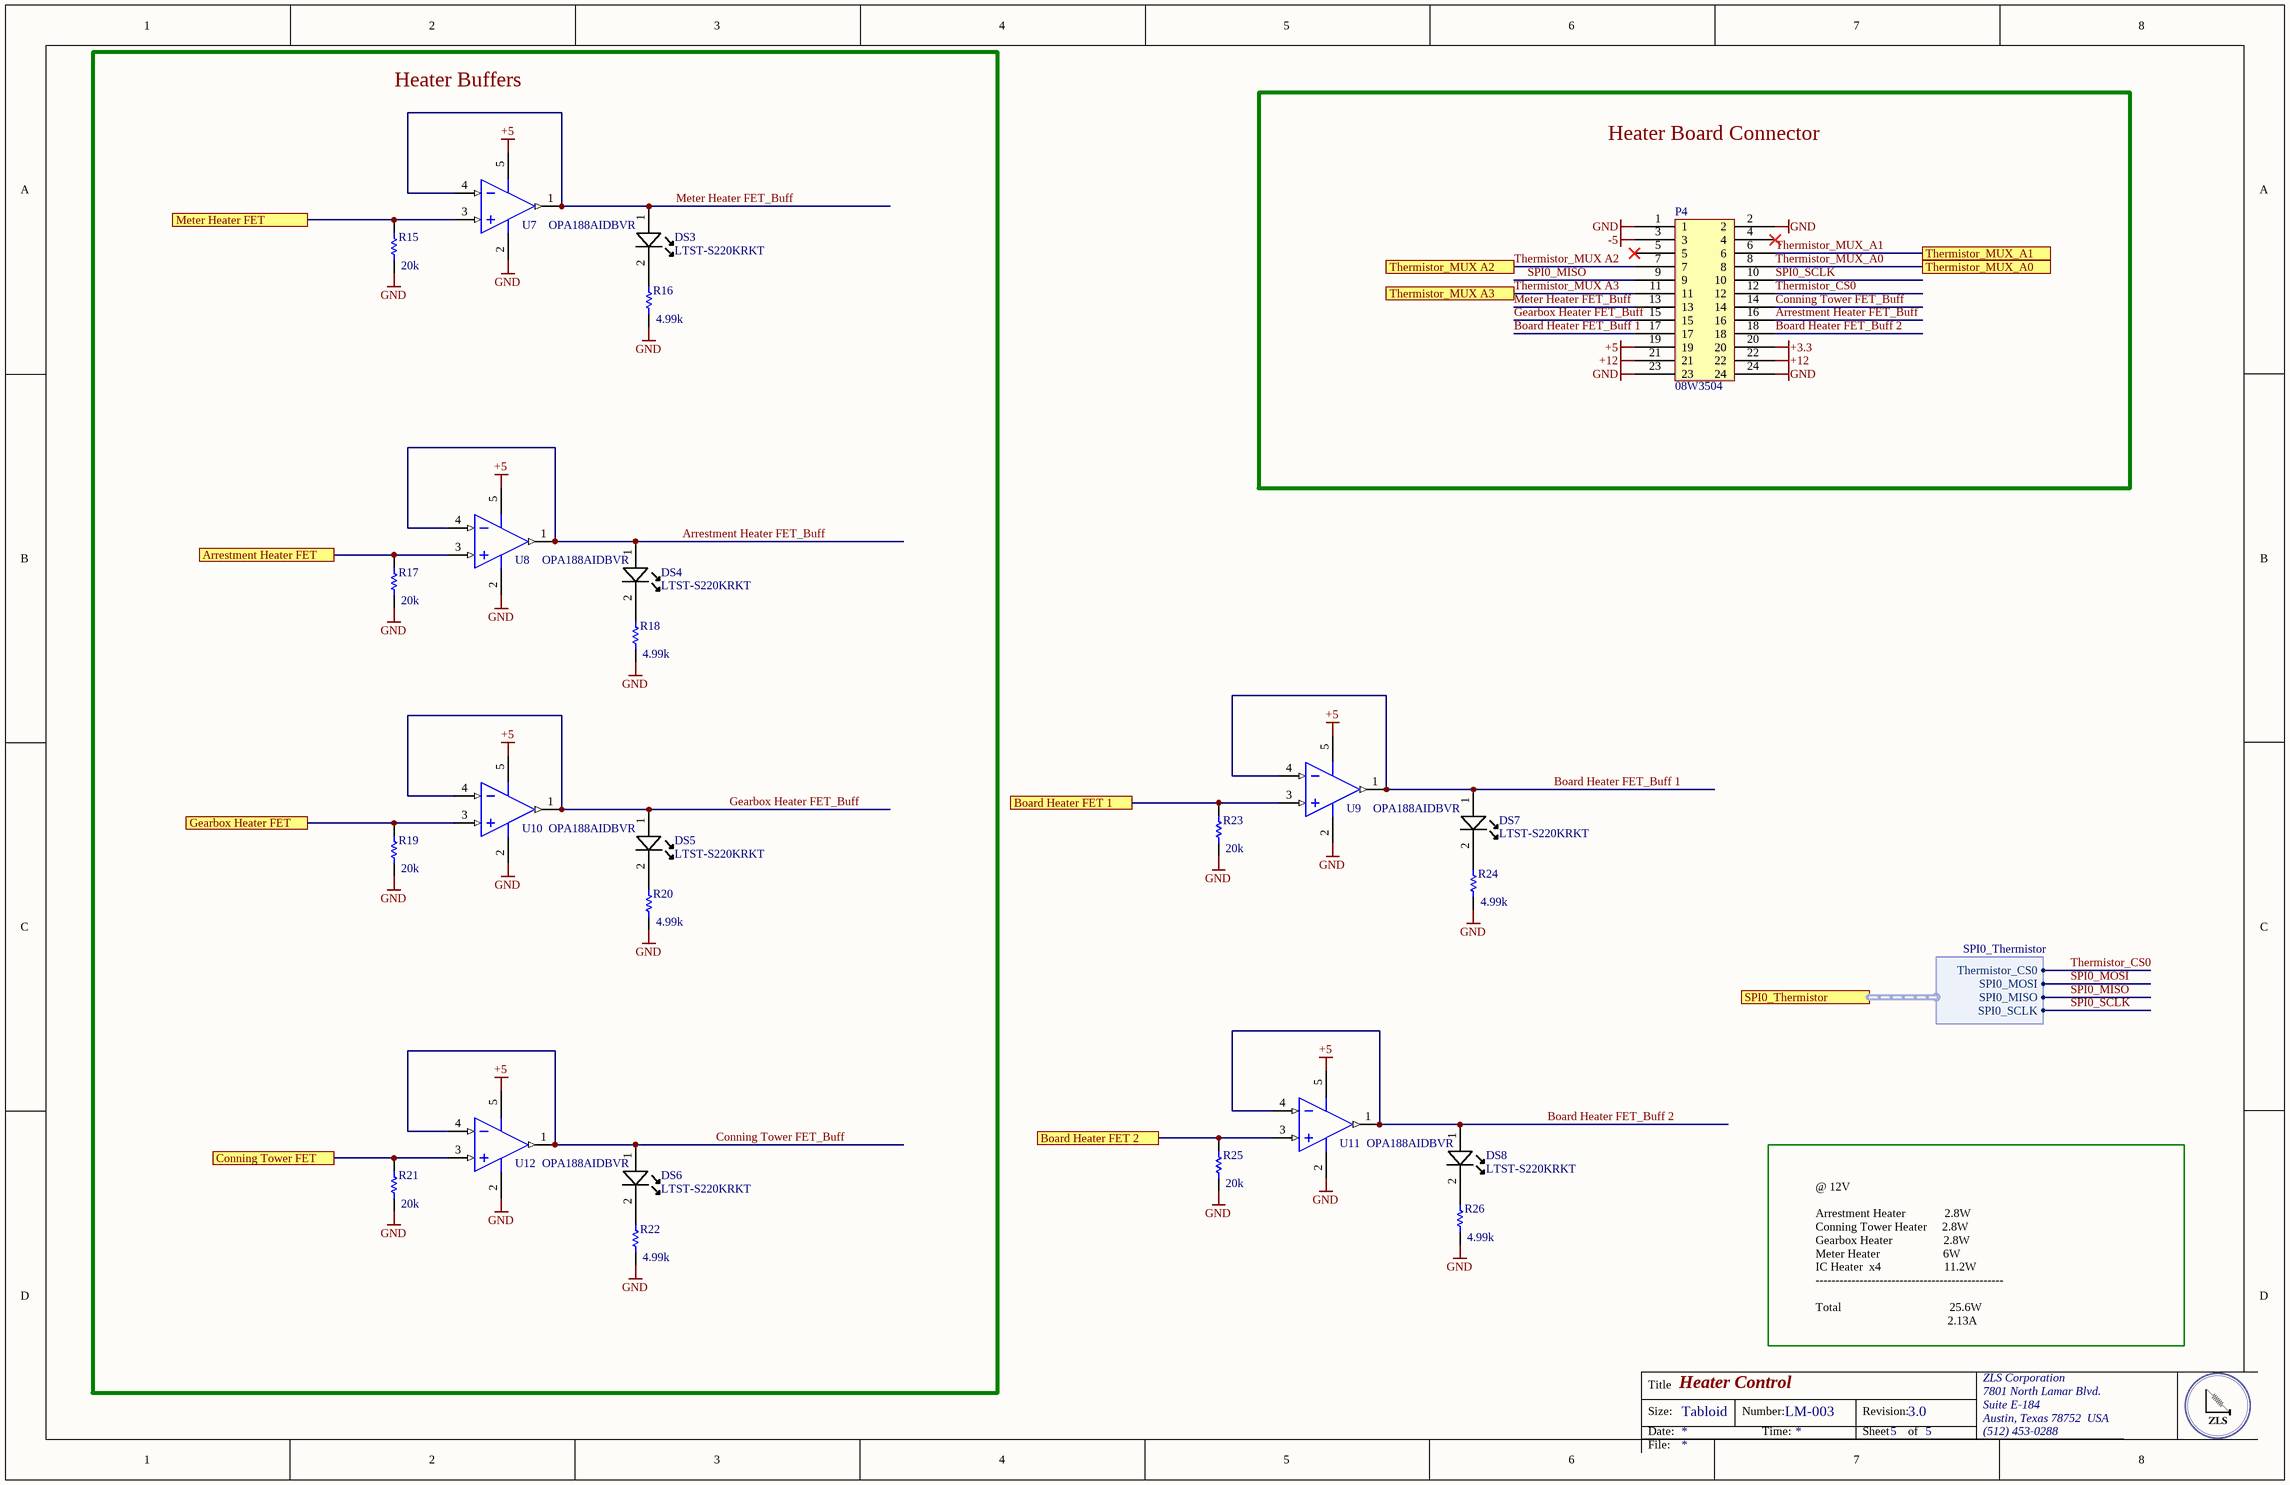
[diagram p3: heater_control.SchDoc]

### Parts
DS3  Manufacturer Part Number: LTST-S220KRKT  [0805C_L]  (hidden comment: Visible Name Value Type    False Description Lite-On LTST-S220KRKT Red LED, 631 nm 2012 (0805) Side View, Rectangle Lens SMD package STRING)
DS4  Manufacturer Part Number: LTST-S220KRKT  [0805C_L]  (hidden comment: Visible Name Value Type    False Description Lite-On LTST-S220KRKT Red LED, 631 nm 2012 (0805) Side View, Rectangle Lens SMD package STRING)
DS5  Manufacturer Part Number: LTST-S220KRKT  [0805C_L]  (hidden comment: Visible Name Value Type    False Description Lite-On LTST-S220KRKT Red LED, 631 nm 2012 (0805) Side View, Rectangle Lens SMD package STRING)
DS6  Manufacturer Part Number: LTST-S220KRKT  [0805C_L]  (hidden comment: Visible Name Value Type    False Description Lite-On LTST-S220KRKT Red LED, 631 nm 2012 (0805) Side View, Rectangle Lens SMD package STRING)
DS7  Manufacturer Part Number: LTST-S220KRKT  [0805C_L]  (hidden comment: Visible Name Value Type    False Description Lite-On LTST-S220KRKT Red LED, 631 nm 2012 (0805) Side View, Rectangle Lens SMD package STRING)
DS8  Manufacturer Part Number: LTST-S220KRKT  [0805C_L]  (hidden comment: Visible Name Value Type    False Description Lite-On LTST-S220KRKT Red LED, 631 nm 2012 (0805) Side View, Rectangle Lens SMD package STRING)
P4  Supplier Part Number 1: 08W3504  [IPL1-112-01-F-S-K]  (hidden comment: IPL1-112-01-F-S-K)
R15  20k  [RESC0402(1005)_M]
R16  4.99k  [RESC0402(1005)_M]
R17  20k  [RESC0402(1005)_M]
R18  4.99k  [RESC0402(1005)_M]
R19  20k  [RESC0402(1005)_M]
R20  4.99k  [RESC0402(1005)_M]
R21  20k  [RESC0402(1005)_M]
R22  4.99k  [RESC0402(1005)_M]
R23  20k  [RESC0402(1005)_M]
R24  4.99k  [RESC0402(1005)_M]
R25  20k  [RESC0402(1005)_M]
R26  4.99k  [RESC0402(1005)_M]
U7  OPA188AIDBVR  [DBV0005A_M]
U8  OPA188AIDBVR  [DBV0005A_M]
U9  OPA188AIDBVR  [DBV0005A_M]
U10  OPA188AIDBVR  [DBV0005A_M]
U11  OPA188AIDBVR  [DBV0005A_M]
U12  OPA188AIDBVR  [DBV0005A_M]

### Blocks framed on the sheet
Heater Buffers: DS3-DS6 R15-R22 U7 U8 U10 U12
Heater Board Connector: P4

### Ports
Arrestment Heater FET, Board Heater FET 1, Board Heater FET 2, Conning Tower FET, Gearbox Heater FET, Meter Heater FET, SPI0_Thermistor (harness SPI0_Thermistor), Thermistor_MUX A2, Thermistor_MUX A3, Thermistor_MUX_A0, Thermistor_MUX_A1

### Harnesses
SPI0_Thermistor: Thermistor_CS0, SPI0_MOSI, SPI0_MISO, SPI0_SCLK

### Nets
+3.3: P4.20
+5: P4.19 U7.5(V+) U8.5(V+) U9.5(V+) U10.5(V+) U11.5(V+) U12.5(V+)
+12: P4.21 P4.22
-5: P4.3
GND: P4.1 P4.2 P4.23 P4.24 R15.2 R16.2 R17.2 R18.2 R19.2 R20.2 R21.2 R22.2 R23.2 R24.2 R25.2 R26.2 U7.2(V-) U8.2(V-) U9.2(V-) U10.2(V-) U11.2(V-) U12.2(V-)
Arrestment Heater FET: R17.1 U8.3(IN+) ; port Arrestment Heater FET
Arrestment Heater FET_Buff: DS4.1(A) P4.16 U8.1(OUT) U8.4(IN-)
Board Heater FET 1: R23.1 U9.3(IN+) ; port Board Heater FET 1
Board Heater FET 2: R25.1 U11.3(IN+) ; port Board Heater FET 2
Board Heater FET_Buff 1: DS7.1(A) P4.17 U9.1(OUT) U9.4(IN-)
Board Heater FET_Buff 2: DS8.1(A) P4.18 U11.1(OUT) U11.4(IN-)
Conning Tower FET: R21.1 U12.3(IN+) ; port Conning Tower FET
Conning Tower FET_Buff: DS6.1(A) P4.14 U12.1(OUT) U12.4(IN-)
Gearbox Heater FET: R19.1 U10.3(IN+) ; port Gearbox Heater FET
Gearbox Heater FET_Buff: DS5.1(A) P4.15 U10.1(OUT) U10.4(IN-)
Meter Heater FET: R15.1 U7.3(IN+) ; port Meter Heater FET
Meter Heater FET_Buff: DS3.1(A) P4.13 U7.1(OUT) U7.4(IN-)
SPI0_MISO: P4.9 ; port SPI0_Thermistor.SPI0_MISO
SPI0_SCLK: P4.10 ; port SPI0_Thermistor.SPI0_SCLK
Thermistor_CS0: P4.12 ; port SPI0_Thermistor.Thermistor_CS0
Thermistor_MUX A2: P4.7 ; port Thermistor_MUX A2
Thermistor_MUX A3: P4.11 ; port Thermistor_MUX A3
Thermistor_MUX_A0: P4.8 ; port Thermistor_MUX_A0
Thermistor_MUX_A1: P4.6 ; port Thermistor_MUX_A1
NetDS3_2: DS3.2(K) R16.1
NetDS4_2: DS4.2(K) R18.1
NetDS5_2: DS5.2(K) R20.1
NetDS6_2: DS6.2(K) R22.1
NetDS7_2: DS7.2(K) R24.1
NetDS8_2: DS8.2(K) R26.1

Not connected (* = marked no-connect by the designer): P4 4* 5*

### Notes on the sheet
- @ 12V
  Arrestment Heater             2.8W
  Conning Tower Heater     2.8W
  Gearbox Heater                 2.8W
  Meter Heater                     6W
  IC Heater  x4                     11.2W
  -----------------------------------------------
  Total                                    25.6W
  2.13A
- Title
- Size:
- Date:
- Tabloid
- Number:
- Time:
- Revision:
- Sheet
- of
- ZLS Corporation
- 7801 North Lamar Blvd.
- Suite E-184
- Austin, Texas 78752  USA
- (512) 453-0288
- File:

### Library data of the parts
DS3-DS8 = LED A/K: Manufacturer: Vishay / Lite-On; Lens Colour: Colorless; Lens Style: Diffused,Colorless; Viewing Angle: 130°; Luminous Intensity: 54mcd; Forward Current: 20mA; Forward Voltage: 2V; Power Rating: 75mW; Dominant Wavelength: 631nm; Lens Transparency: Clear; Number of Elements: 1; Wavelength: 639nm; Supplier 1: Digi-Key; Supplier Part Number 1: 160-1469-1-ND; Stock 1: 108191; Pricing 1: 1=0.31, 10=0.225, 25=0.1656, 100=0.1183, 250=0.0804, 500=0.071, 1000=0.0556 (USD); Mount: Surface Mount; Case/Package: 0805; Number of Pins: 2; Colour: Red; Case Code (Metric): 2012; Case Code (Imperial): 0805; Min Operating Temperature: -55°C; Max Operating Temperature: 85°C; Packaging: Tape and Reel; Package Quantity: 4000; Illumination Colour: Red; Test Current: 20mA; Power Dissipation: 75mW; Number of LEDs: 1; Length: 2.1mm; Height: 0.6mm; Width: 1mm; Depth: 0.6mm; Radiation Hardening: No; Lead Free: Lead Free; ComponentLink1URL: https://datasheet.ciiva.com/2110/s-110-ltst-s220krkt-2110132.pdf; ComponentLink1Description: https://datasheet.ciiva.com/2110/s-110-ltst-s220krkt-2110132.pdf; ComponentLink2URL: https://datasheet.ciiva.com/2110/s-110-ltst-s220krkt-2110133.pdf; ComponentLink2Description: https://datasheet.ciiva.com/2110/s-110-ltst-s220krkt-2110133.pdf; ComponentLink3URL: https://datasheet.ciiva.com/2110/s-110-ltst-s220krkt-2110134.pdf; ComponentLink3Description: https://datasheet.ciiva.com/2110/s-110-ltst-s220krkt-2110134.pdf; ComponentLink4URL: https://datasheet.ciiva.com/12403/lite-on-ltst-s220krkt-187389-12403798.pdf; ComponentLink4Description: https://datasheet.ciiva.com/12403/lite-on-ltst-s220krkt-187389-12403798.pdf; ComponentLink5URL: https://datasheet.ciiva.com/16345/lite-onltst-s220krkt-16345511.pdf; ComponentLink5Description: https://datasheet.ciiva.com/16345/lite-onltst-s220krkt-16345511.pdf; ComponentLink6URL: https://datasheet.ciiva.com/15118/getdatasheetpartid-225752-15118120.pdf; ComponentLink6Description: https://datasheet.ciiva.com/15118/getdatasheetpartid-225752-15118120.pdf; ComponentLink7URL: https://datasheet.ciiva.com/14633/0900766b80dc0b76-14633737.pdf; ComponentLink7Description: https://datasheet.ciiva.com/14633/0900766b80dc0b76-14633737.pdf; ComponentLink8URL: https://datasheet.ciiva.com/11775/0900766b80dc0b76-11775439.pdf; ComponentLink8Description: https://datasheet.ciiva.com/11775/0900766b80dc0b76-11775439.pdf
P4 = IPL1-112-01-F-S-K: IPL1-112-01-F-D-K; Supplier 1: Newark
R15-R26 = CMP-1011-00651-1
U7-U12 = CMP-0809-00005-2: as U4 on sheet Power; PartNumber: OPA188AIDBVR; ComponentLink2Description: Datasheet; ComponentLink2URL: http://www.ti.com/lit/ds/symlink/opa188.pdf; ComponentLink1Description: Manufacturer URL; Mounting Technology: Surface Mount; Eco-Plan: Green (RoHS & no Sb/Br); ComponentLink1URL: http://www.ti.com/; PackageVersion: 4073253-4/K, 03/2006; DatasheetVersion: SBOS642A; ComponentLink3Description: Package Specification; PackageReference: DBV0005A; ComponentLink3URL: http://www.ti.com/litv/pdf/mpds018i; PackageDescription: 5-Pin Plastic Small Outline, Body 1.6 x 2.9 mm, Pitch 0.95 mm; Code_JEDEC: MO-178

## Nets that join several sheets
+3.3: Power (5 pins), BBB Headers (U5.9-15 U6.2 U6.13), Connectors (P1.26 P2.21), heater_control (P4.20)
+5: Power (10 pins), Connectors (P1.21 P2.19), heater_control (7 pins)
+5 BBB: Power (R8.2), BBB Headers (U5.9-5 U5.9-6), Connectors (P1.2)
+12: Power (R2.2), Connectors (P1.29 P1.30 P2.25), heater_control (P4.21 P4.22)
-5: Power (R12.1), Connectors (P1.25 P2.27), heater_control (P4.3)
GND: Power (19 pins), BBB Headers (10 pins), Connectors (11 pins), heater_control (22 pins)
Arrestment Heater FET: BBB Headers (U5.8-6), heater_control (R17.1 U8.3)
Batt_1_Stat: BBB Headers (U5.8-37), Connectors (P2.6)
Batt_2_Stat: BBB Headers (U5.8-38), Connectors (P2.7)
BBB_PWR_SW: BBB Headers (U5.9-9), Connectors (P1.4)
Board Heater FET 1: BBB Headers (U5.8-7), heater_control (R23.1 U9.3)
Board Heater FET 2: BBB Headers (U5.8-8), heater_control (R25.1 U11.3)
Conning Tower FET: BBB Headers (U5.8-4), heater_control (R21.1 U12.3)
FB_CS0: BBB Headers (U6.4), Connectors (P1.5 P2.3)
FB_MUX_A0: BBB Headers (U5.8-25), Connectors (P2.16)
FB_MUX_A1: BBB Headers (U5.8-26), Connectors (P2.15)
Gearbox Heater FET: BBB Headers (U5.8-3), heater_control (R19.1 U10.3)
Meter Heater FET: BBB Headers (U5.8-5), heater_control (R15.1 U7.3)
Power_MUX_A0: BBB Headers (U5.8-14), Connectors (P1.11)
Power_MUX_A1: BBB Headers (U5.8-15), Connectors (P1.13)
Power_MUX_A2: BBB Headers (U5.8-16), Connectors (P1.15)
PWM1A: BBB Headers (U5.9-14), Connectors (P1.8)
PWM2A: BBB Headers (U5.8-19), Connectors (P2.11)
PWM2B: BBB Headers (U5.8-13), Connectors (P2.13)
SPI0_MISO: BBB Headers (U5.9-21), Connectors (P1.12), heater_control (P4.9)
SPI0_MOSI: BBB Headers (U5.9-18), Connectors (P1.10)
SPI0_SCLK: BBB Headers (U5.9-22), Connectors (P1.14), heater_control (P4.10)
Sys_Pwr_Enable: BBB Headers (U5.8-22), Connectors (P2.9)
Thermistor_CS0: BBB Headers (U6.5), heater_control (P4.12)
Thermistor_MUX A2: BBB Headers (U5.8-44), heater_control (P4.7)
Thermistor_MUX A3: BBB Headers (U5.8-45), heater_control (P4.11)
Thermistor_MUX_A0: BBB Headers (U5.8-42), heater_control (P4.8)
Thermistor_MUX_A1: BBB Headers (U5.8-43), heater_control (P4.6)